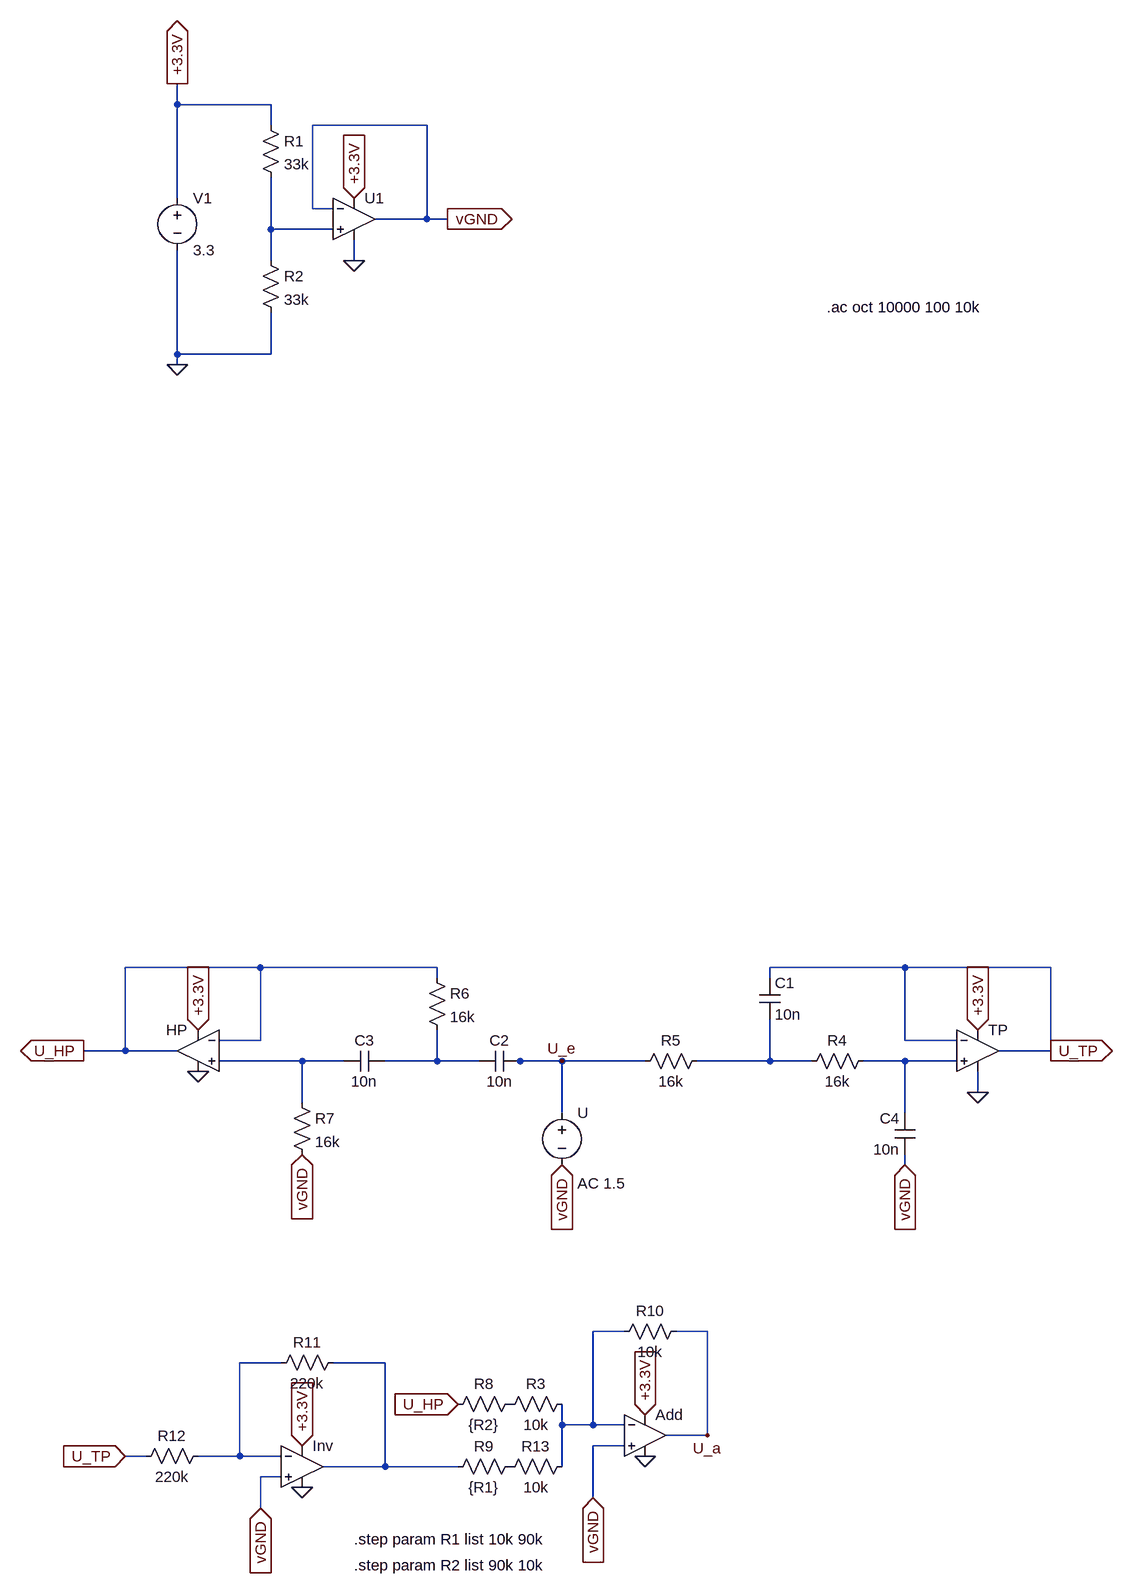
[diagram p0: schematic Circuit_Add_VariableRes.asc]
Circuit_Add_VariableRes.asc, the LTspice schematic file:
Version 4
SHEET 1 2296 2652
WIRE 64 -16 64 -48
WIRE 208 -16 64 -16
WIRE 208 16 208 -16
WIRE 448 16 272 16
WIRE 64 128 64 -16
WIRE 272 144 272 16
WIRE 304 144 272 144
WIRE 448 160 448 16
WIRE 448 160 368 160
WIRE 480 160 448 160
WIRE 208 176 208 96
WIRE 304 176 208 176
WIRE 208 224 208 176
WIRE 336 224 336 192
WIRE 64 368 64 208
WIRE 208 368 208 304
WIRE 208 368 64 368
WIRE 64 384 64 368
WIRE 192 1312 -16 1312
WIRE 464 1312 192 1312
WIRE 1184 1312 976 1312
WIRE 1408 1312 1184 1312
WIRE 464 1328 464 1312
WIRE 976 1328 976 1312
WIRE 192 1424 192 1312
WIRE 192 1424 128 1424
WIRE 1184 1424 1184 1312
WIRE 1264 1424 1184 1424
WIRE -16 1440 -16 1312
WIRE -16 1440 -80 1440
WIRE 64 1440 -16 1440
WIRE 1408 1440 1408 1312
WIRE 1408 1440 1328 1440
WIRE 256 1456 128 1456
WIRE 320 1456 256 1456
WIRE 464 1456 464 1408
WIRE 464 1456 384 1456
WIRE 528 1456 464 1456
WIRE 592 1456 576 1456
WIRE 656 1456 592 1456
WIRE 784 1456 656 1456
WIRE 976 1456 976 1392
WIRE 976 1456 864 1456
WIRE 1040 1456 976 1456
WIRE 1184 1456 1120 1456
WIRE 1264 1456 1184 1456
WIRE 1296 1504 1296 1472
WIRE 256 1520 256 1456
WIRE 656 1536 656 1456
WIRE 1184 1536 1184 1456
WIRE 1184 1616 1184 1600
WIRE 752 1872 704 1872
WIRE 880 1872 832 1872
WIRE 224 1920 160 1920
WIRE 384 1920 304 1920
WIRE 656 2016 656 1984
WIRE 704 2016 704 1872
WIRE 704 2016 656 2016
WIRE 752 2016 704 2016
WIRE 880 2032 880 1872
WIRE 880 2032 816 2032
WIRE 752 2048 704 2048
WIRE 16 2064 -16 2064
WIRE 160 2064 160 1920
WIRE 160 2064 96 2064
WIRE 224 2064 160 2064
WIRE 384 2080 384 1920
WIRE 384 2080 288 2080
WIRE 496 2080 384 2080
WIRE 656 2080 656 2016
WIRE 224 2096 192 2096
WIRE 704 2128 704 2048
WIRE 192 2144 192 2096
FLAG 336 224 0
FLAG 336 128 +3.3V
IOPIN 336 128 In
FLAG 64 -48 +3.3V
IOPIN 64 -48 Out
FLAG 64 384 0
FLAG 480 160 vGND
IOPIN 480 160 Out
FLAG 1296 1504 0
FLAG 656 1616 vGND
IOPIN 656 1616 In
FLAG 1184 1616 vGND
IOPIN 1184 1616 In
FLAG 1296 1408 +3.3V
IOPIN 1296 1408 In
FLAG 656 1456 U_e
FLAG 96 1408 +3.3V
IOPIN 96 1408 In
FLAG 96 1472 0
FLAG 256 1600 vGND
IOPIN 256 1600 In
FLAG -80 1440 U_HP
IOPIN -80 1440 Out
FLAG 1408 1440 U_TP
IOPIN 1408 1440 Out
FLAG 496 1984 U_HP
IOPIN 496 1984 In
FLAG -16 2064 U_TP
IOPIN -16 2064 In
FLAG 784 2000 +3.3V
IOPIN 784 2000 In
FLAG 784 2064 0
FLAG 880 2032 U_a
FLAG 704 2128 vGND
IOPIN 704 2128 In
FLAG 256 2048 +3.3V
IOPIN 256 2048 In
FLAG 256 2112 0
FLAG 192 2144 vGND
IOPIN 192 2144 In
SYMBOL voltage 64 112 R0
WINDOW 123 0 0 Left 0
WINDOW 39 0 0 Left 0
SYMATTR InstName V1
SYMATTR Value 3.3
SYMBOL OpAmps\\UniversalOpAmp2 336 160 R0
SYMATTR InstName U1
SYMBOL res 192 0 R0
SYMATTR InstName R1
SYMATTR Value 33k
SYMBOL res 192 208 R0
SYMATTR InstName R2
SYMATTR Value 33k
SYMBOL voltage 656 1520 R0
WINDOW 123 24 124 Left 2
WINDOW 39 0 0 Left 0
SYMATTR Value2 AC 1.5
SYMATTR InstName U
SYMATTR Value ""
SYMBOL res 880 1440 R90
WINDOW 0 0 56 VBottom 2
WINDOW 3 32 56 VTop 2
SYMATTR InstName R5
SYMATTR Value 16k
SYMBOL cap 960 1328 R0
SYMATTR InstName C1
SYMATTR Value 10n
SYMBOL cap 1200 1600 R180
WINDOW 0 24 56 Left 2
WINDOW 3 24 8 Left 2
SYMATTR InstName C4
SYMATTR Value 10n
SYMBOL res 1136 1440 R90
WINDOW 0 0 56 VBottom 2
WINDOW 3 32 56 VTop 2
SYMATTR InstName R4
SYMATTR Value 16k
SYMBOL OpAmps\\UniversalOpAmp2 1296 1440 R0
SYMATTR InstName TP
SYMBOL cap 592 1440 R90
WINDOW 0 0 32 VBottom 2
WINDOW 3 32 32 VTop 2
SYMATTR InstName C2
SYMATTR Value 10n
SYMBOL cap 384 1440 R90
WINDOW 0 0 32 VBottom 2
WINDOW 3 32 32 VTop 2
SYMATTR InstName C3
SYMATTR Value 10n
SYMBOL res 448 1312 R0
SYMATTR InstName R6
SYMATTR Value 16k
SYMBOL OpAmps\\UniversalOpAmp2 96 1440 M0
SYMATTR InstName HP
SYMBOL res 240 1504 R0
SYMATTR InstName R7
SYMATTR Value 16k
SYMBOL OpAmps\\UniversalOpAmp2 784 2032 R0
SYMATTR InstName Add
SYMBOL res 592 1968 R90
WINDOW 0 0 56 VBottom 2
WINDOW 3 32 56 VTop 2
SYMATTR InstName R8
SYMATTR Value {R2}
SYMBOL res 592 2064 R90
WINDOW 0 0 56 VBottom 2
WINDOW 3 32 56 VTop 2
SYMATTR InstName R9
SYMATTR Value {R1}
SYMBOL res 848 1856 R90
WINDOW 0 0 56 VBottom 2
WINDOW 3 32 56 VTop 2
SYMATTR InstName R10
SYMATTR Value 10k
SYMBOL OpAmps\\UniversalOpAmp2 256 2080 R0
SYMATTR InstName Inv
SYMBOL res 320 1904 R90
WINDOW 0 0 56 VBottom 2
WINDOW 3 32 56 VTop 2
SYMATTR InstName R11
SYMATTR Value 220k
SYMBOL res 112 2048 R90
WINDOW 0 0 56 VBottom 2
WINDOW 3 32 56 VTop 2
SYMATTR InstName R12
SYMATTR Value 220k
SYMBOL res 672 1968 R90
WINDOW 0 0 56 VBottom 2
WINDOW 3 32 56 VTop 2
SYMATTR InstName R3
SYMATTR Value 10k
SYMBOL res 672 2064 R90
WINDOW 0 0 56 VBottom 2
WINDOW 3 32 56 VTop 2
SYMATTR InstName R13
SYMATTR Value 10k
TEXT 1064 296 Left 2 !.ac oct 10000 100 10k
TEXT 336 2192 Left 2 !.step param R1 list 10k 90k
TEXT 336 2232 Left 2 !.step param R2 list 90k 10k

The netlist it stands for:
* Circuit_Add_VariableRes.asc
V1 +3.3V 0 3.3
XU1 N001 vGND +3.3V 0 vGND level2 Avol=1Meg GBW=10Meg Slew=10Meg Ilimit=25m Rail=0 Vos=0 En=0 Enk=0 In=0 Ink=0 Rin=500Meg  ; pins In+ In- V+ V- OUT
R1 +3.3V N001 33k
R2 N001 0 33k
V§U U_e vGND AC 1.5
R5 N004 U_e 16k
C1 U_TP N004 10n
C4 vGND N005 10n
R4 N005 N004 16k
XTP N005 U_TP +3.3V 0 U_TP level2 Avol=1Meg GBW=10Meg Slew=10Meg Ilimit=25m Rail=0 Vos=0 En=0 Enk=0 In=0 Ink=0 Rin=500Meg  ; pins In+ In- V+ V- OUT
C2 U_e N003 10n
C3 N003 N002 10n
R6 U_HP N003 16k
XHP N002 U_HP +3.3V 0 U_HP level2 Avol=1Meg GBW=10Meg Slew=10Meg Ilimit=25m Rail=0 Vos=0 En=0 Enk=0 In=0 Ink=0 Rin=500Meg  ; pins In+ In- V+ V- OUT
R7 N002 vGND 16k
XAdd vGND N006 +3.3V 0 U_a level2 Avol=1Meg GBW=10Meg Slew=10Meg Ilimit=25m Rail=0 Vos=0 En=0 Enk=0 In=0 Ink=0 Rin=500Meg  ; pins In+ In- V+ V- OUT
R8 P001 U_HP {R2}
R9 P002 N008 {R1}
R10 U_a N006 10k
XInv vGND N007 +3.3V 0 N008 level2 Avol=1Meg GBW=10Meg Slew=10Meg Ilimit=25m Rail=0 Vos=0 En=0 Enk=0 In=0 Ink=0 Rin=500Meg  ; pins In+ In- V+ V- OUT
R11 N008 N007 220k
R12 N007 U_TP 220k
R3 N006 P001 10k
R13 N006 P002 10k
.ac oct 10000 100 10k
.step param R1 list 10k 90k
.step param R2 list 90k 10k
.lib UniversalOpAmp2.lib
.backanno
.end